# Altium schematic sheet 17_I2C_Sensor_OnBoard.SchDoc
size 420 x 297 mm; SheetNumber: 28; SheetTotal: 36
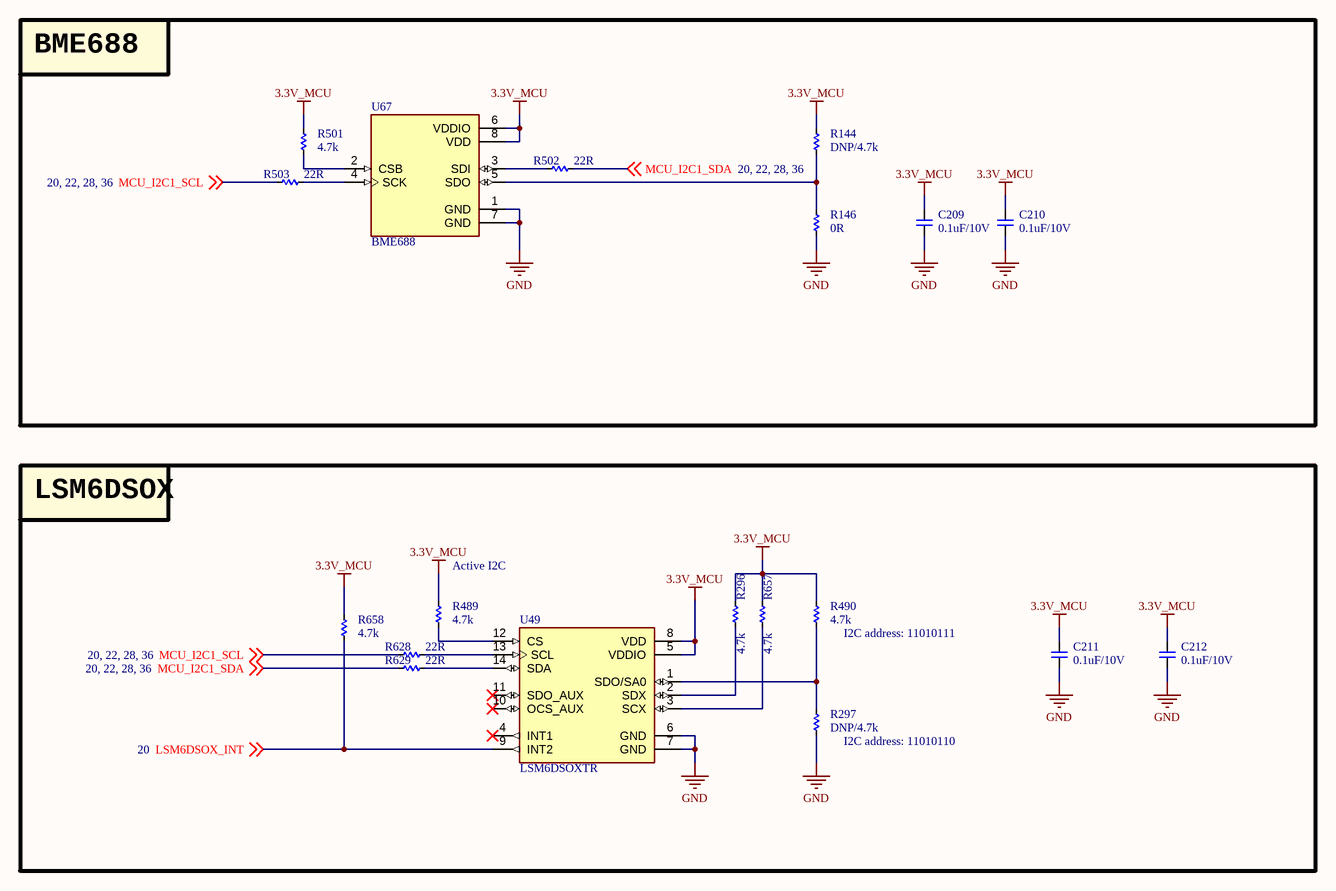
[diagram p0: 17_I2C_Sensor_OnBoard.SchDoc]

## Parts
C209  0.1uF/10V  [CAP_C_1005X60]
C210  0.1uF/10V  [CAP_C_1005X60]
C211  0.1uF/10V  [CAP_C_1005X60]
C212  0.1uF/10V  [CAP_C_1005X60]
R144  DNP/4.7k  [RES_C_1005X40]
R146  0R  [RES_C_1005X40]
R296  4.7k  [RES_C_1005X40]
R297  DNP/4.7k  [RES_C_1005X40]
R489  4.7k  [RES_C_1005X40]
R490  4.7k  [RES_C_1005X40]
R501  4.7k  [RES_C_1005X40]
R502  22R  [RES_C_1005X40]
R503  22R  [RES_C_1005X40]
R628  22R  [RES_C_1005X40]
R629  22R  [RES_C_1005X40]
R657  4.7k  [RES_C_1005X40]
R658  4.7k  [RES_C_1005X40]
U49  LSM6DSOXTR  [PQFN50P250X300X86-14N]
U67  BME688  [IC_BME688]

## Blocks framed on the sheet
BME688: C209 C210 R144 R146 R501-R503 U67
LSM6DSOX: C211 C212 R296 R297 R489 R490 R628 R629 R657 R658 U49

## Nets
3.3V_MCU: C209.2 C210.2 C211.2 C212.2 R144.1 R296.1 R489.1 R490.1 R501.1 R657.1 R658.1 U49.5(VDDIO) U49.8(VDD) U67.6(VDDIO) U67.8(VDD)
GND: C209.1 C210.1 C211.1 C212.1 R146.2 R297.2 U49.6(GND) U49.7(GND) U67.1(GND) U67.7(GND)
LSM6DSOX_INT: R658.2 U49.9(INT2) ; off-sheet LSM6DSOX_INT
MCU_I2C1_SCL: R503.1 R628.1 ; off-sheet MCU_I2C1_SCL
MCU_I2C1_SDA: R502.2 R629.1 ; off-sheet MCU_I2C1_SDA
NetR144_2: R144.2 R146.1 U67.5(SDO)
NetR296_2: R296.2 U49.2(SDX)
NetR297_1: R297.1 R490.2 U49.1(SDO/SA0)
NetR489_2: R489.2 U49.12(CS)
NetR501_2: R501.2 U67.2(CSB)
NetR502_1: R502.1 U67.3(SDI)
NetR503_2: R503.2 U67.4(SCK)
NetR628_2: R628.2 U49.13(SCL)
NetR629_2: R629.2 U49.14(SDA)
NetR657_2: R657.2 U49.3(SCX)

Not connected (* = marked no-connect by the designer): U49 4(INT1)* 10(OCS_AUX)* 11(SDO_AUX)*

## Notes on the sheet
- (near R489) Active I2C
- (near R490) I2C address: 11010111
- (near R297) I2C address: 11010110
- Project:
- Sub-system:
- Design by:
- Sheet title:
- Sheet
- of
- Checked by:
- Approved by:
- Revision:
- Document No:
- Size:
- Date:
- A3

## Library data of the parts
C209-C212 = _CAP_C_2: CAP
R144 R146 R296 R297 R489 R490 R501-R503 R628 R629 R657 R658 = _RES_B_2: RES
U49 = LSM6DSOXTR: Accelerometer, Gyroscope, 6 Axis Sensor I2C, SPI Output; MF: STMicroelectronics; SnapEDA_Link: https://www.snapeda.com/parts/LSM6DSOXTR/STMicroelectronics/view-part/?ref=snap; Package: VFLGA-14 STMicroelectronics; Value: *; MP: LSM6DSOXTR; Check_prices: https://www.snapeda.com/parts/LSM6DSOXTR/STMicroelectronics/view-part/?ref=eda
U67 = BME688: Gas sensor measuring relative humidity, barometric pressure, ambient temperature and gas (VOC); Package: None; MP: BME688; Price: None; Availability: Unavailable; Value: *